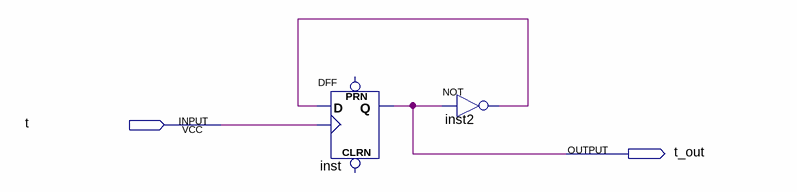
[diagram p0: schematic sheet]
// Quartus schematic t_flip_flop.bdf as structural Verilog: 2 symbols, 2 pins
module t_flip_flop (
  input  t,
  output t_out
);

  wire inst2_out;

  DFF inst (.CLK(t), .D(inst2_out), .Q(t_out));  // open: CLRN, PRN
  not inst2 (inst2_out, t_out);
endmodule
